# Altium schematic sheet Mixer_module.SchDoc
size A
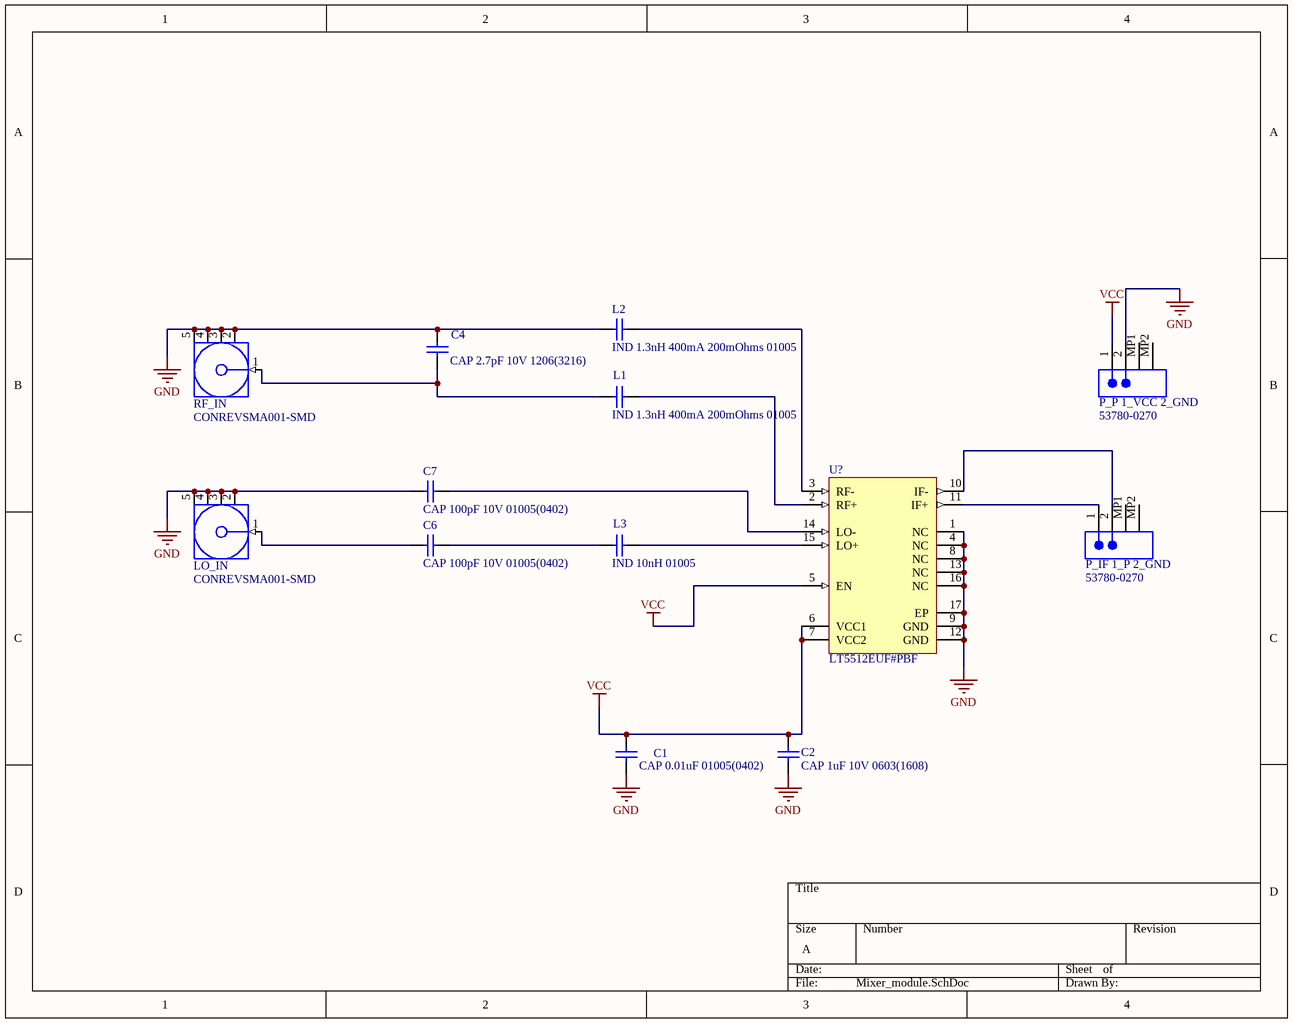
[diagram p0: Mixer_module.SchDoc]

## Parts
C1  CAP 0.01uF 01005(0402)  [CAPC01005(0402)22_N]
C2  CAP 1uF 10V 0603(1608)  [CAPC0603(1608)100_M]
C4  CAP 2.7pF 10V 1206(3216)  [CAPC1206(3216)100_N]
C6  CAP 100pF 10V 01005(0402)  [CAPC01005(0402)22_N]
C7  CAP 100pF 10V 01005(0402)  [CAPC01005(0402)22_N]
L1  IND 1.3nH 400mA 200mOhms 01005  [CAPC01005(0402)22_L]
L2  IND 1.3nH 400mA 200mOhms 01005  [CAPC01005(0402)22_L]
L3  IND 10nH 01005  [CAPC01005(0402)22_L]
LO_IN  CONREVSMA001-SMD  [CON-REVSMA-SMD]
P_IF_1_P_2_GND  53780-0270  [HEAD-SM1-25-2H2M]
P_P_1_VCC_2_GND  53780-0270  [HEAD-SM1-25-2H2M]
RF_IN  CONREVSMA001-SMD  [CON-REVSMA-SMD]
U?  LT5512EUF#PBF  [LT-UF-16_L]

## Nets
GND: C1.2 C2.1 C4.2 C7.1 L2.1 LO_IN.2(GND) LO_IN.3(GND) LO_IN.4(GND) LO_IN.5(GND) P_P_1_VCC_2_GND.2 RF_IN.2(GND) RF_IN.3(GND) RF_IN.4(GND) RF_IN.5(GND) U?.1(NC) U?.4(NC) U?.8(NC) U?.9(GND) U?.12(GND) U?.13(NC) U?.16(NC) U?.17(EP)
VCC: C1.1 C2.2 P_P_1_VCC_2_GND.1 U?.5(EN) U?.6(VCC1) U?.7(VCC2)
NetC4_1: C4.1 L1.1 RF_IN.1(Signal)
NetC6_1: C6.1 LO_IN.1(Signal)
NetC6_2: C6.2 L3.1
NetC7_2: C7.2 U?.14(LO-)
NetL1_2: L1.2 U?.2(RF+)
NetL2_2: L2.2 U?.3(RF-)
NetL3_2: L3.2 U?.15(LO+)
NetP_IF_1_P_2_GND_1: P_IF_1_P_2_GND.1 U?.11(IF+)
NetP_IF_1_P_2_GND_2: P_IF_1_P_2_GND.2 U?.10(IF-)

Not connected (* = marked no-connect by the designer): P_IF_1_P_2_GND MP1(Metal_Plane_1) MP2(Metal_Plane_2); P_P_1_VCC_2_GND MP1(Metal_Plane_1) MP2(Metal_Plane_2)

## Library data of the parts
C1 C6 C7 = CMP-1032-00399-1: CAP 100pF 10V ±5% 01005 (0402 Metric) Thickness 0.22mm SMD; Case-Metric: 0402; Case-EIA: 01005; Tolerance: Â±5%; Technology: SMT; Rated Voltage: 10 V; Value: 100pF; Max Thickness: 0.22 mm
C2 = CMP-1035-02733-1: CAP 1uF 10V ±10% 0603 (1608 Metric) Thickness 1mm SMD; Tolerance: Â±10%; Case-EIA: 0603; Case-Metric: 1608; Rated Voltage: 10 V; Max Thickness: 1 mm; Value: 1uF; Technology: SMT
C4 = CMP-1037-00207-1: CAP 2.7pF 10V ±0.1pF 1206 (3216 Metric) Thickness 1mm SMD; Case-EIA: 1206; Case-Metric: 3216; Tolerance: Â±0.1pF; Technology: SMT; Rated Voltage: 10 V; Max Thickness: 1 mm; Value: 2.7pF
L1-L3 = CMP-1590-00012-1: 01005 (0402 Metric) Chip Capacitor; Case-EIA: 01005; Case-Metric: 0402; PackageReference: CAPC01005(0402)22
LO_IN RF_IN = CMP-0168-00009-1: RP-SMA Female Surface Mount Connector; PackageDescription: RP-SMA Female PCB Mount, Surface Mount Connector, 7 x 7 mm Body; DatasheetVersion: rev1, May-2006; PackageVersion: rev1, May-2006; PackageReference: CON-REVSMA-SMD
P_IF_1_P_2_GND P_P_1_VCC_2_GND = CMP-0001-00087-1: Header, Wire-to-Board, SMT, Horizontal, 1-Row, Pitch 1.25mm, 2-Position; Mating Connector: Molex-51146-0200; Publisher: Altium; ClassName: Header; Component Kind: Standard; Package Reference: HEAD-SM1-25-2H2M; Package Version: Apr-2004; Datasheet Version: Apr-2004
U? = CMP-1649-00001-1: High Signal Level Active Mixer, 4.5 to 5.25 V, -40 to 85 degC, 16-Pin QFN (UF), RoHS, Tube; Generic Part Number: LT5512; Supply Voltage Max: 5.25 V; Frequency: 1000 Hz; Supply Voltage Min: 4.5 V; PackageDescription: 16-Pin Plastic Quad Flat No-lead Package, Body 4 x 4 mm, Pitch 0.65 mm; DatasheetVersion: Rev. A; ComponentLink3Description: Package Specification; ComponentLink1URL: http://www.linear.com/; PackageVersion: 06/2010; ComponentLink3URL: http://cds.linear.com/docs/en/packaging/QFN_16_05-08-1692.pdf; Code_JEDEC: MO-220; Mounting Technology: Surface Mount; RoHS: TRUE; Packing: Tube; ComponentLink2Description: Datasheet; Temperature Min: -40 degC; ComponentLink1Description: Manufacturer URL; Temperature Max: 85 degC; PartNumber: LT5512EUF#PBF; ComponentLink2URL: http://cds.linear.com/docs/en/datasheet/5512fa.pdf